# EAGLE design SIDEPANEL3.1 (EAGLE 7.2.0)
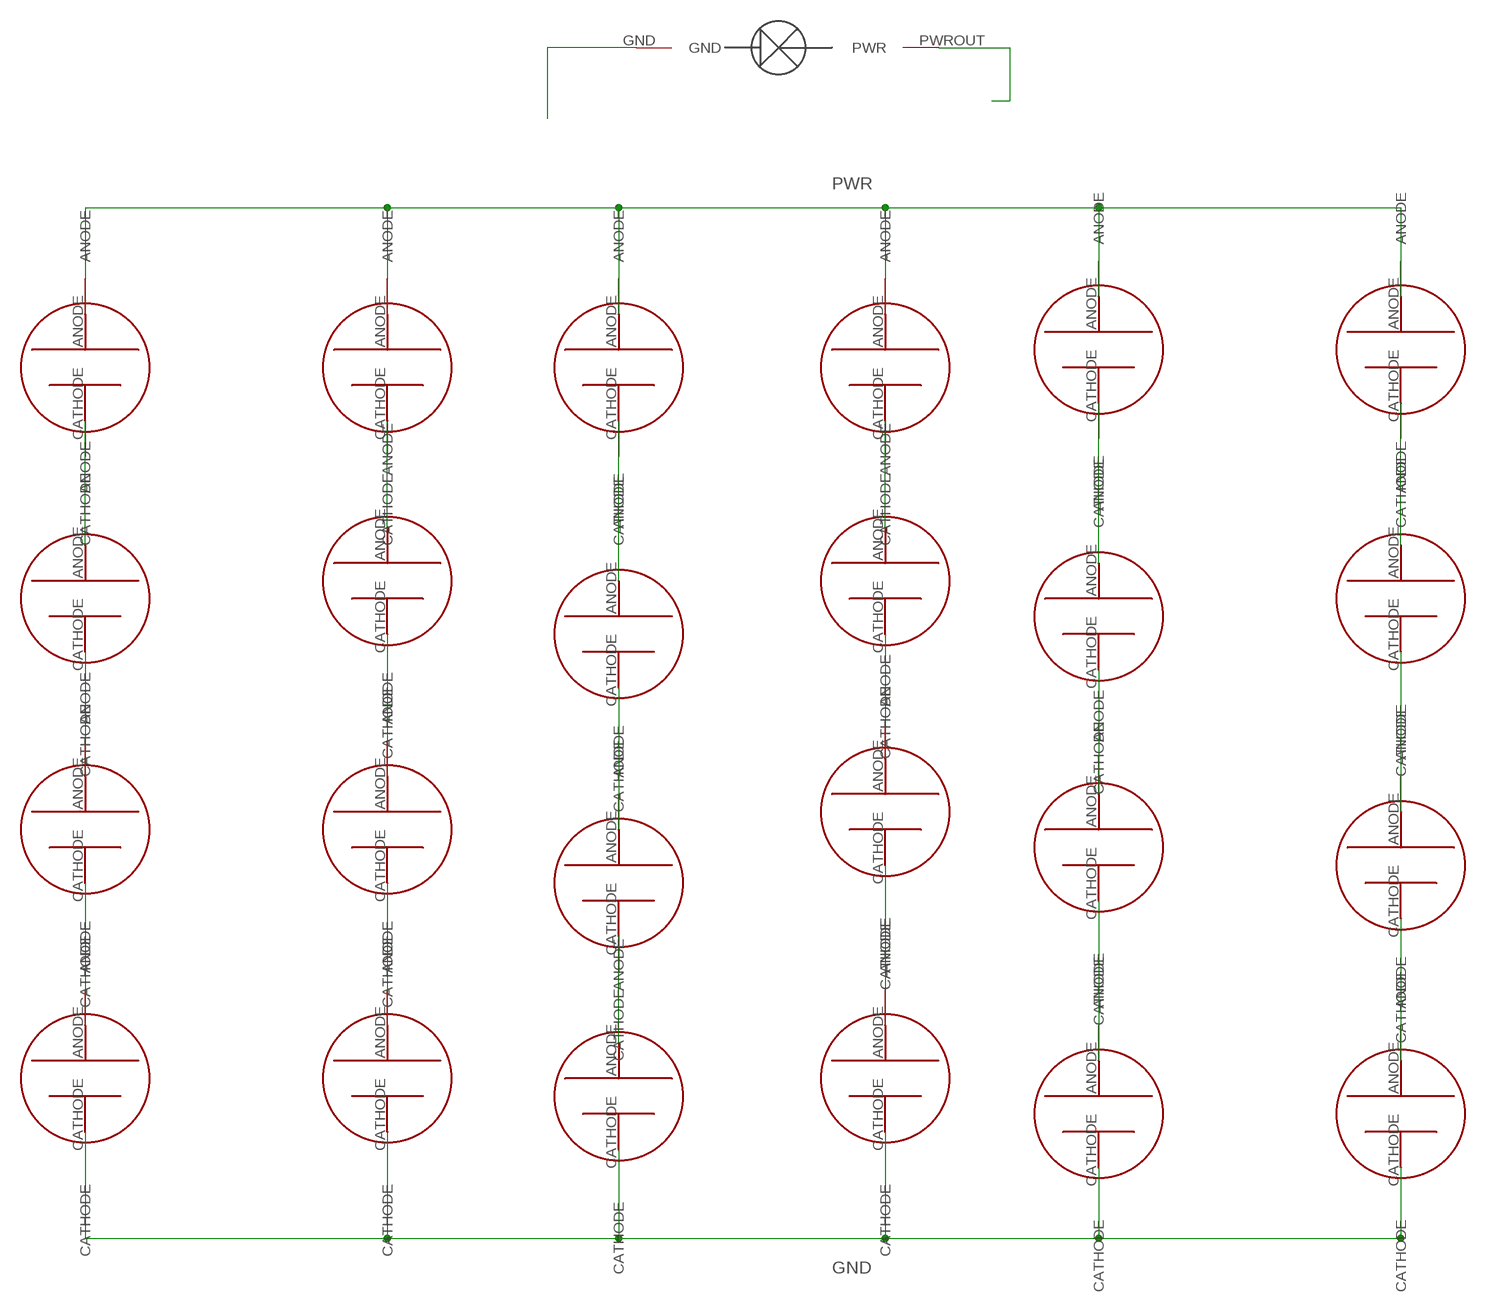
[diagram p0: schematic, sheet 1]

## Parts
1A  NEWSOLARPANEL  [SOLARCELL2]
1B  NEWSOLARPANEL  [SOLARCELL2]
1C  NEWSOLARPANEL  [SOLARCELL2]
1D  NEWSOLARPANEL  [SOLARCELL2]
1F  NEWSOLARPANEL  [SOLARCELL2]
1G  NEWSOLARPANEL  [SOLARCELL2]
2A  NEWSOLARPANEL  [SOLARCELL2]
2B  NEWSOLARPANEL  [SOLARCELL2]
2C  NEWSOLARPANEL  [SOLARCELL2]
2D  NEWSOLARPANEL  [SOLARCELL2]
2F  NEWSOLARPANEL  [SOLARCELL2]
2G  NEWSOLARPANEL  [SOLARCELL2]
3A  NEWSOLARPANEL  [SOLARCELL2]
3B  NEWSOLARPANEL  [SOLARCELL2]
3C  NEWSOLARPANEL  [SOLARCELL2]
3D  NEWSOLARPANEL  [SOLARCELL2]
3F  NEWSOLARPANEL  [SOLARCELL2]
3G  NEWSOLARPANEL  [SOLARCELL2]
4A  NEWSOLARPANEL  [SOLARCELL2]
4B  NEWSOLARPANEL  [SOLARCELL2]
4C  NEWSOLARPANEL  [SOLARCELL2]
4D  NEWSOLARPANEL  [SOLARCELL2]
4F  NEWSOLARPANEL  [SOLARCELL2]
4G  NEWSOLARPANEL  [SOLARCELL2]
U$1  PHOTODETECTOR  [PHOTODECTORDEVICE2]

## Nets
GND: 4A.CATHODE 4B.CATHODE 4C.CATHODE 4D.CATHODE 4F.CATHODE 4G.CATHODE U$1.GND
N$1: 2A.CATHODE 3A.ANODE
N$2: 1C.CATHODE 2C.ANODE
N$3: 2B.CATHODE 3B.ANODE
N$4: 2C.CATHODE 3C.ANODE
N$5: 2D.CATHODE 3D.ANODE
N$6: 3C.CATHODE 4C.ANODE
N$8: 2F.CATHODE 3F.ANODE
N$9: 1B.CATHODE 2B.ANODE
N$10: 2G.CATHODE 3G.ANODE
N$11: 3G.CATHODE 4G.ANODE
N$12: 1D.CATHODE 2D.ANODE
N$13: 3F.CATHODE 4F.ANODE
N$15: 3D.CATHODE 4D.ANODE
N$16: 3B.CATHODE 4B.ANODE
N$17: 3A.CATHODE 4A.ANODE
N$18: 1A.CATHODE 2A.ANODE
N$24: 1G.CATHODE 2G.ANODE
N$32: 1F.CATHODE 2F.ANODE
PDOUT: U$1.PWROUT(PWR)
PWR: 1A.ANODE 1B.ANODE 1C.ANODE 1D.ANODE 1F.ANODE 1G.ANODE

## Library data of the parts
1A 1B 1C 1D 1F 1G 2A 2B 2C 2D 2F 2G 3A 3B 3C 3D 3F 3G 4A 4B 4C 4D 4F 4G = solarcellnew:NEWSOLARPANEL
U$1 = solarcellnew:PHOTODETECTOR

## Board
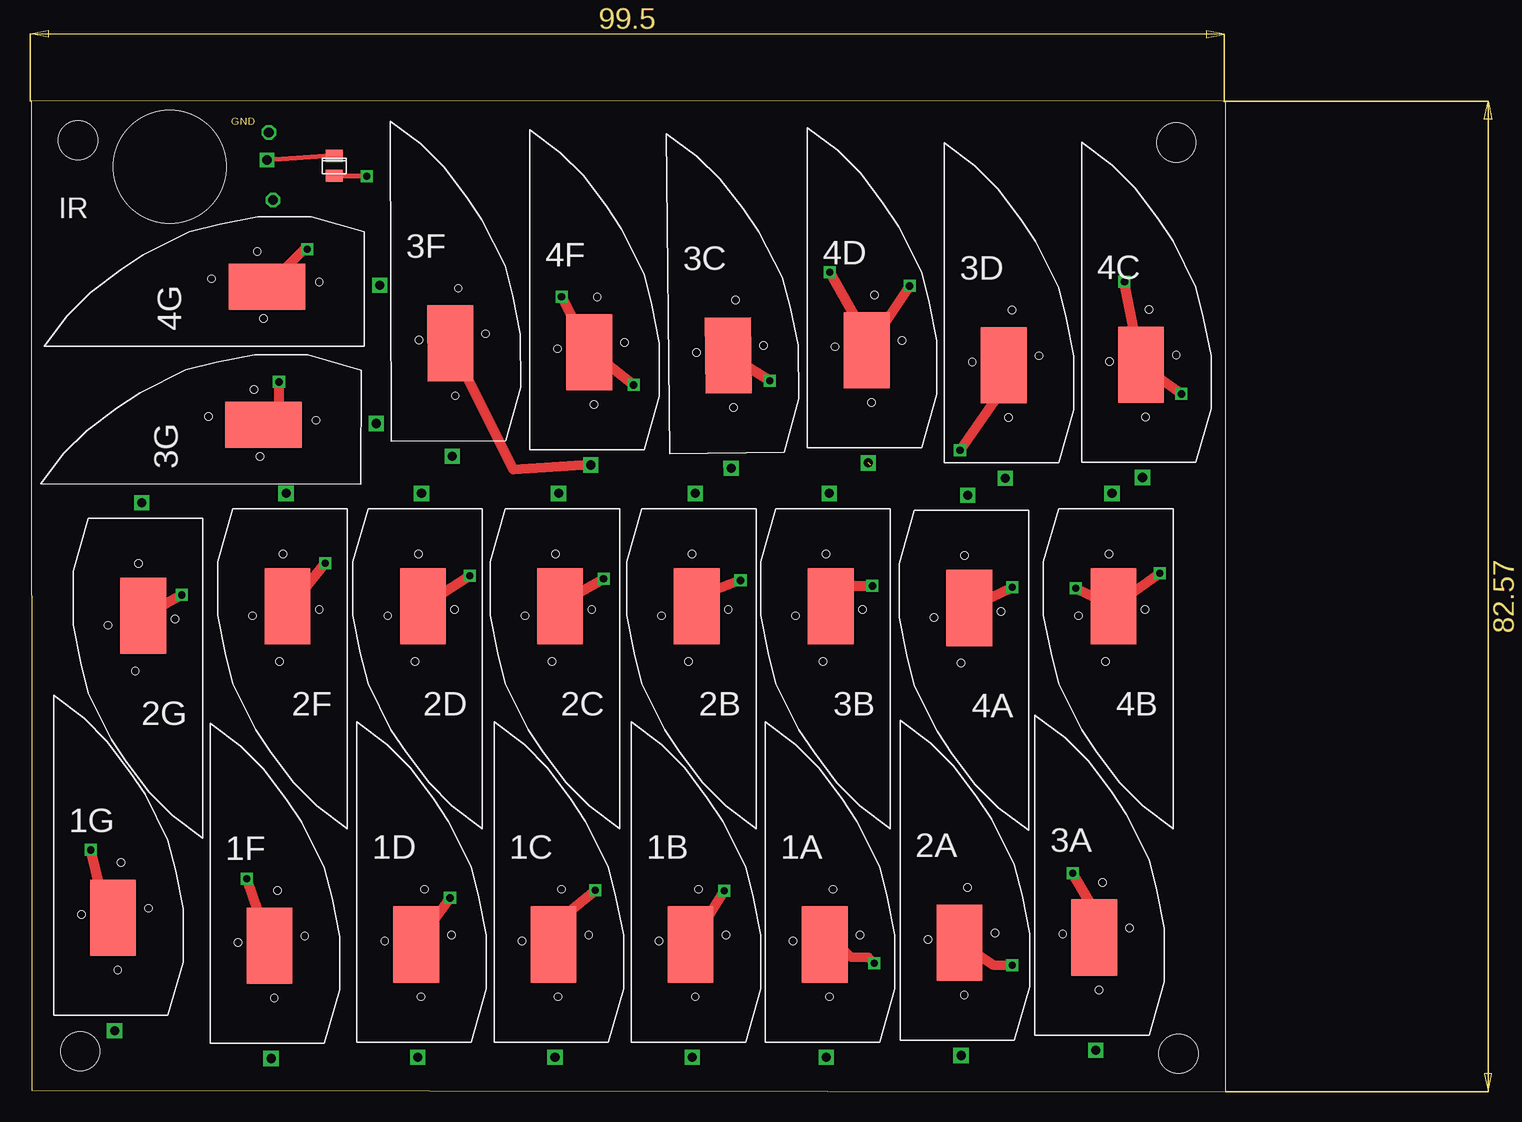
[diagram p1: board, top side]
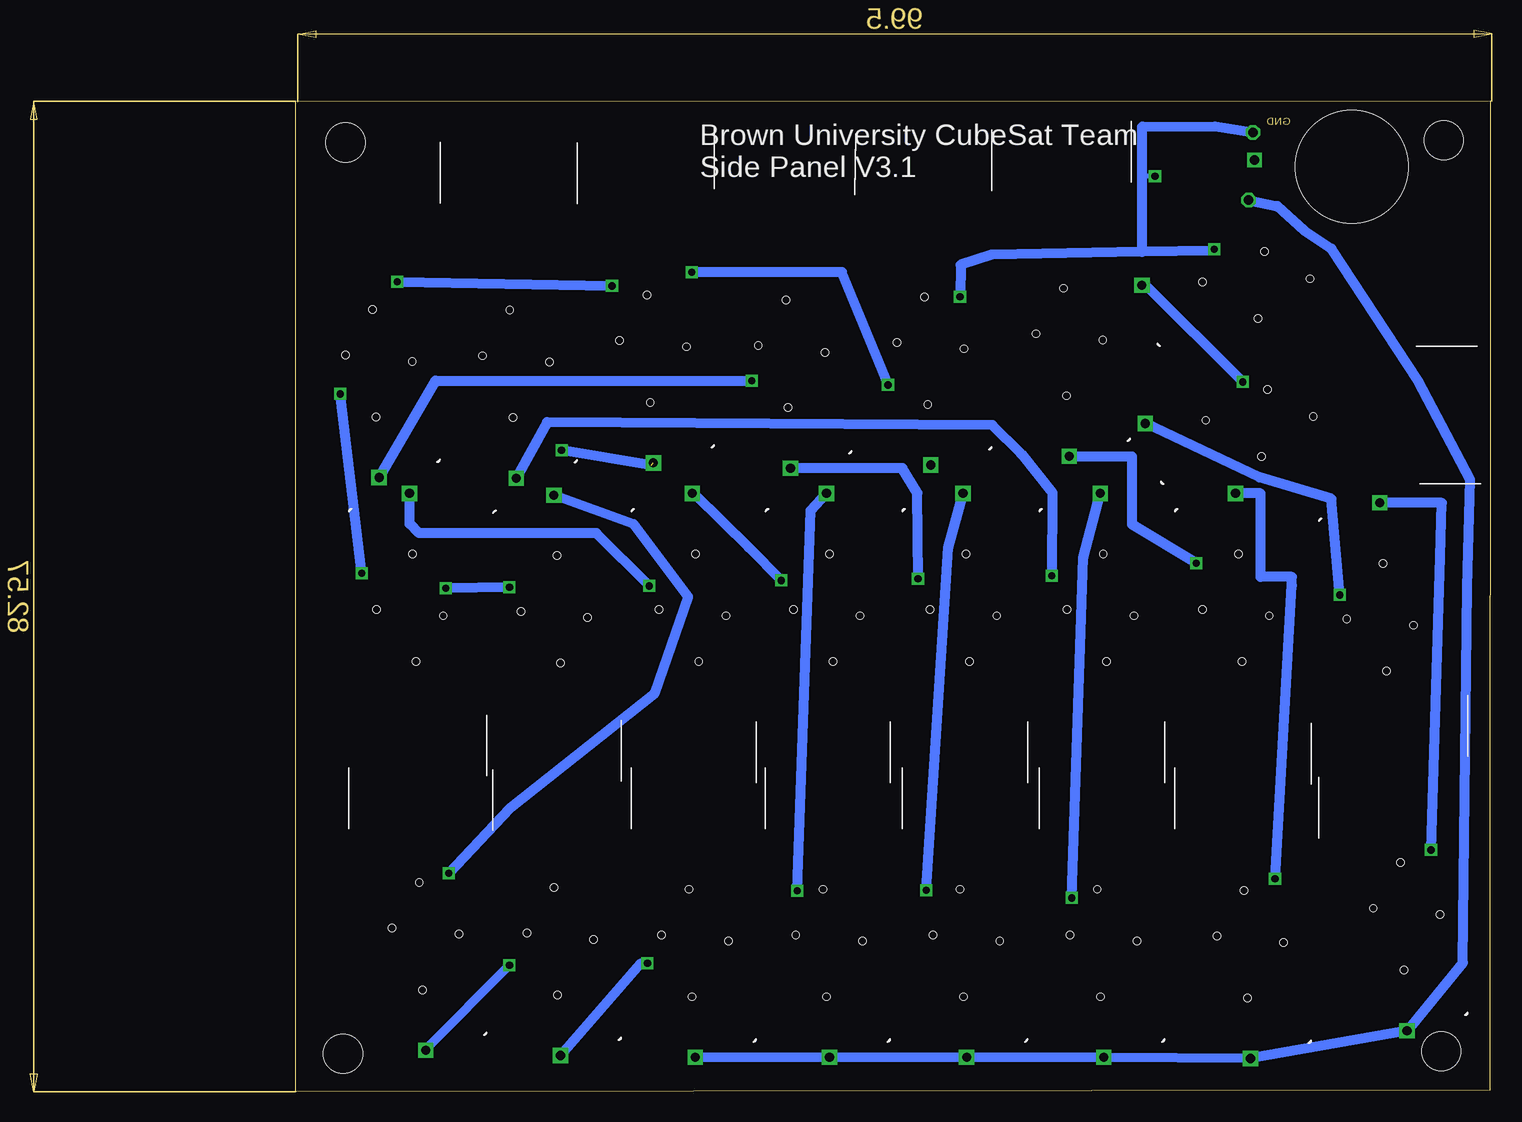
[diagram p2: board, bottom side, seen from below]

Size 99.54 x 82.62 mm. Coordinates in mm from the lower left corner, seen from the top.
Outline: 0.05,0.15 99.54,0 99.54,82.57 0,82.62 0.05,0.15
Copper layers (1*16): Top 0.035mm / dielectric 1.5mm / Bottom 0.035mm
Design rules "default": minimum track width 10mil, minimum drill 24mil, track to track 8mil, track to pad 8mil, pad to pad 8mil, via to via 8mil, smd to smd 8mil, copper to edge 40mil, drill to drill 8mil, minimum pad ring 10mil, minimum via ring 8mil, stop-mask expansion 4mil, vias tented up to drill 0mil, thermal gap 10mil
Holes 3.26 mm at 3.89,79.31 4.09,3.39 95.62,3.19 95.42,79.11
Holes 9.4 mm at 11.55,77.12

### Footprints (pad centres in the part's own frame; a part is rotated, then mirrored left to right if it is on the bottom)
SOLARCELL2 = drill 0.76 square: ANODE 5.08,-1.27 | smd 3.81 x 6.35: CATHODE 4.953,8.128 | hole 0.6: 2.32,8.41; 5.62,12.73; 7.89,8.93; 5.34,3.77
PHOTODECTORDEVICE2 = smd 1 x 1.45: GND 0.76,0.4; PWROUT -0.88,0.4

### Placement (x,y rotation side)
1A  61.18,4.16 0 top
1B  50,4.16 0 top
1C  38.57,4.16 0 top
1D  27.14,4.16 0 top
1F  14.91,4.06 0 top
1G  1.87,6.38 0 top
2A  72.41,4.31 0 top
2B  60.41,48.61 180 top
2C  49.03,48.61 180 top
2D  37.6,48.61 180 top
2F  26.32,48.61 180 top
2G  14.29,47.82 180 top
3A  83.64,4.74 0 top
3B  71.59,48.61 180 top
3C  53.23,53.19 0.7 top
3D  76.1,52.42 0 top
3F  30.01,54.23 0.2 top
3G  27.48,50.63 89.9 top
4A  83.12,48.46 180 top
4B  95.15,48.61 180 top
4C  87.53,52.47 0 top
4D  64.67,53.69 0 top
4F  41.55,53.52 0 top
4G  27.77,62.15 90 top
U$1  24.85,77.12 270 top

### Tracks (layer width: path | path; a pad name or v marks a point on that pad's centre or on a via)
GND  (via drill 0.6, 0.8)
  Top 0.406: U$1.GND 27.91,76.36 v27.95,76.32
  Top 0.83: 4A.CATHODE v81.75,42.07 | v87.05,41.97 4B.CATHODE v94.05,43.22 | v95.85,58.17 4C.CATHODE v91.1,67.52 | v73.2,67.17 4D.CATHODE 69.62,62.85 v66.55,68.32 | 4G.CATHODE 22.76,70.22 v23,70.22 | v44.2,66.27 45.25,64.12 4F.CATHODE 46.62,61.77 v50.2,58.92
  Bottom 0.406: 29,80.47 29.05,80.42 | 29,70.12 29.05,70.12 29.05,70.01 | v27.95,76.32 29.03,76.32
  Bottom 0.813: 29,70.12 29.03,76.32 29,80.47 | 29.05,80.42 22.95,80.47 v19.8,79.97
  Bottom 0.83: v81.75,42.07 v87.05,41.97 | v94.05,43.22 v95.85,58.17 | v91.1,67.52 v73.2,67.17 | v23,70.22 23.1,70.12 29.05,70.01 41.55,69.77 44.15,68.92 v44.2,66.27 | v50.2,58.92 54.05,68.32 v66.55,68.32
N$1  (via drill 0.6)
  Top 0.8: 2A.CATHODE 80.23,10.57 v81.75,10.57
  Bottom 0.8: v81.75,10.57 88.7,3.62 3A.ANODE
N$2  (via drill 0.6)
  Top 0.813: 1C.CATHODE 44.22,14.5 v47,16.82
  Bottom 0.813: v47,16.82 45.2,45.37
  Bottom 0.83: 45.2,45.37 2C.ANODE
N$3  (via drill 0.6)
  Top 0.813: 2B.CATHODE 55.53,41.25
  Top 0.83: v59.11,42.63 55.53,41.25
  Bottom 0.83: 3B.ANODE 66.3,49.82 61.81,45.38 v59.11,42.63
N$4  (via drill 0.6)
  Top 0.83: 2C.CATHODE 44.55,40.95 v47.7,42.77
  Bottom 0.83: v47.7,42.77 47.75,49.92 49,51.97 49.01,51.98 3C.ANODE
N$5  (via drill 0.6)
  Top 0.83: v36.55,43.02 2D.CATHODE
  Bottom 0.83: v36.55,43.02 36.5,49.92 39.1,53.17 41.5,55.57 78.6,55.82 3D.ANODE
N$6  (via drill 0.6)
  Top 0.83: v61.55,59.27 3C.CATHODE
  Bottom 0.83: 4C.ANODE 87.9,59.27 v61.55,59.27
N$8  (via drill 0.6)
  Top 0.83: 2F.CATHODE 22.65,41.77 v24.5,44.07
  Bottom 0.83: v24.5,44.07 29.85,47.27 29.85,52.97 3F.ANODE
N$9  (via drill 0.6)
  Top 0.83: 1B.CATHODE v57.75,16.77
  Bottom 0.83: v57.75,16.77 56.65,48.47 2B.ANODE
N$10  (via drill 0.6)
  Top 0.83: 2G.CATHODE v12.55,41.42
  Bottom 0.83: v12.55,41.42 13.25,49.42 19.26,51.21 3G.ANODE
N$11  (via drill 0.6)
  Top 0.83: 3G.CATHODE 20.65,56.89 v20.65,59.17
  Bottom 0.83: v20.65,59.17 28.71,67.23 4G.ANODE
N$12  (via drill 0.6)
  Top 0.83: 1D.CATHODE v34.9,16.17
  Bottom 0.83: v34.9,16.17 33.95,44.52 2D.ANODE
N$13
  Top 0.83: 4F.ANODE 40.2,51.87 3F.CATHODE
N$15  (via drill 0.6)  (1 unrouted)
  Top 0.813: 3D.CATHODE 81.05,58.67
  Top 0.83: v77.4,53.47 81.05,58.67
  Bottom 0.83: 69.95,52.22 v77.4,53.47
N$16  (via drill 0.6)
  Top 0.83: 3B.CATHODE 68.33,42.17 v70.1,42.17
  Bottom 0.83: v70.1,42.17 74.5,46.57 89.3,46.57 90.07,47.34 4B.ANODE
N$17  (via drill 0.6)
  Top 0.813: 3A.CATHODE 88.59,15.18 v86.8,18.22
  Bottom 0.813: v86.8,18.22 81.7,23.67 69.65,33.22 66.85,41.27 71.4,47.32
  Bottom 0.83: 71.4,47.32 4A.ANODE
N$18  (via drill 0.6)
  Top 0.8: v70.25,10.72 69.75,11.22 68.35,11.22 67.28,12.29 1A.CATHODE
  Bottom 0.8: 2A.ANODE 70.81,10.72 v70.25,10.72
N$24  (via drill 0.6)
  Top 0.83: 1G.CATHODE 6.25,14.88 v4.95,20.17
  Bottom 0.83: v4.95,20.17 4.2,44.62 4.05,49.09 2G.ANODE
N$32  (via drill 0.6)
  Top 0.83: 1F.CATHODE v17.95,17.77
  Bottom 0.83: v17.95,17.77 16.55,42.22 16.55,42.92 19.15,42.92 19.15,49.88 2F.ANODE
PDOUT  (via drill 0.8)
  Top 0.406: v19.65,77.67 25.07,78.07 U$1.PWROUT
PWR  (via drill 0.8)
  Bottom 0.8: 1F.ANODE 1D.ANODE 1C.ANODE 1B.ANODE 1A.ANODE
  Bottom 0.813: v20.15,74.32 17.75,73.82 15.55,71.82 13.25,70.27 6,59.22 1.7,51.02 1.95,42.07 2.3,10.77 1G.ANODE 1F.ANODE

### Text on the board
Dimension: GND | height: 82.5 | width:99.50 | Corner-hole diamter: 3.26 | distance between center of holes (height):76 | distance between holes (width):91.5 | distance from center of hole to short side:4 | distance from center of hole to long side: 3.25
tPlace: IR
bPlace: Brown University CubeSat Team / Side Panel V3.1
Document: PD OUT | PWR OUT